# Altium schematic sheet PL_Ethernet.SchDoc: PL_Ethernet
size A3; Author: Carlos Barreiro; Organization: Escuela Técnica Superior de Ingeniería de Sistemas Informáticos de la Universidad Politécnica de Madrid; Address1: Campus Sur de la Universidad Politécnica de Madrid; Address2: Calle de Alan Turing, s/nº; Address3: Madrid 28031; Address4: España; DocumentNumber: 15; SheetNumber: 15; SheetTotal: 16
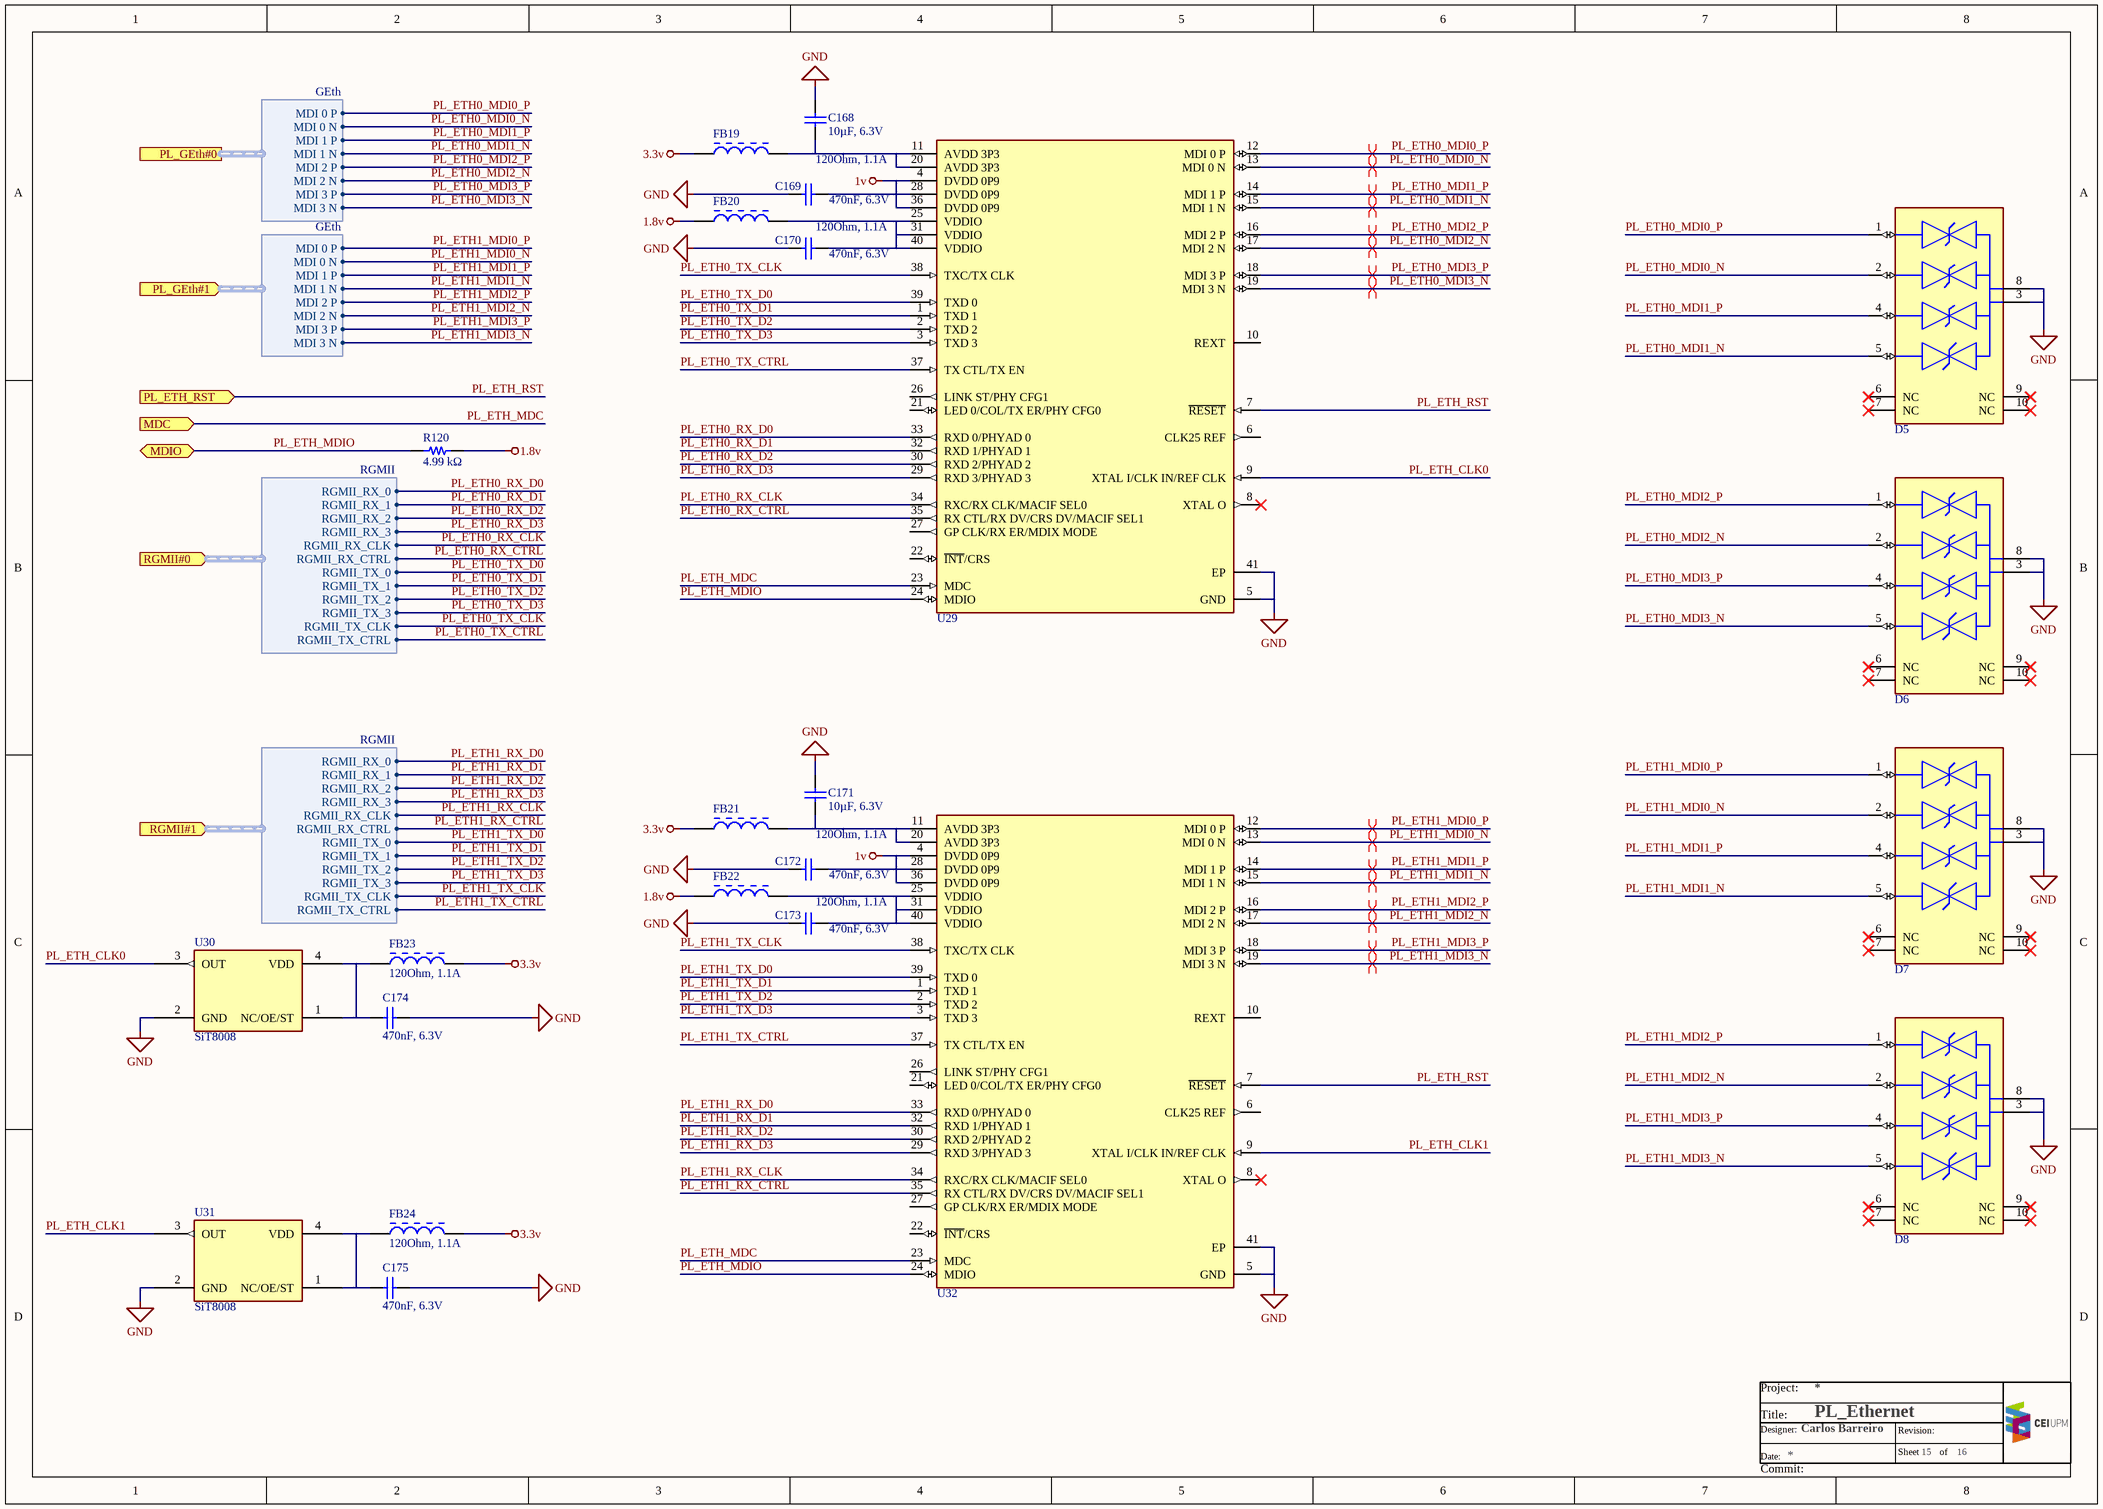
[diagram p0: PL_Ethernet.SchDoc]

## Parts
C168  10µF, 6.3V  [WURTH_WCAP-CSGP_0402]
C169  470nF, 6.3V  [WURTH_WCAP-CSGP_0402]
C170  470nF, 6.3V  [WURTH_WCAP-CSGP_0402]
C171  10µF, 6.3V  [WURTH_WCAP-CSGP_0402]
C172  470nF, 6.3V  [WURTH_WCAP-CSGP_0402]
C173  470nF, 6.3V  [WURTH_WCAP-CSGP_0402]
C174  470nF, 6.3V  [WURTH_WCAP-CSGP_0402]
C175  470nF, 6.3V  [WURTH_WCAP-CSGP_0402]
D5  ESD204DQAR  [TEXAS_USON10]  (value not drawn)
D6  ESD204DQAR  [TEXAS_USON10]  (value not drawn)
D7  ESD204DQAR  [TEXAS_USON10]  (value not drawn)
D8  ESD204DQAR  [TEXAS_USON10]  (value not drawn)
FB19  120Ohm, 1.1A  [WURTH-CBF_0402]
FB20  120Ohm, 1.1A  [WURTH-CBF_0402]
FB21  120Ohm, 1.1A  [WURTH-CBF_0402]
FB22  120Ohm, 1.1A  [WURTH-CBF_0402]
FB23  120Ohm, 1.1A  [WURTH-CBF_0402]
FB24  120Ohm, 1.1A  [WURTH-CBF_0402]
R120  4.99 kΩ  [PANASONIC_ERJ2G_0402]
U29  ADIN1300CCPZ  [ADI_LFCSP40]  (value not drawn)
U30  SiT8008  [SiTime_5032_4]
U31  SiT8008  [SiTime_5032_4]
U32  ADIN1300CCPZ  [ADI_LFCSP40]  (value not drawn)

## Ports
MDC (in), MDIO (bidir), PL_ETH_RST (in), PL_GEth#0 (harness GEth), PL_GEth#1 (in, harness GEth), RGMII#0 (in, harness RGMII), RGMII#1 (in, harness RGMII)

## Harnesses
GEth: MDI 0 P, MDI 0 N, MDI 1 P, MDI 1 N, MDI 2 P, MDI 2 N, MDI 3 P, MDI 3 N
RGMII: RGMII_RX_0, RGMII_RX_1, RGMII_RX_2, RGMII_RX_3, RGMII_RX_CLK, RGMII_RX_CTRL, RGMII_TX_0, RGMII_TX_1, RGMII_TX_2, RGMII_TX_3, RGMII_TX_CLK, RGMII_TX_CTRL

## Nets
1.8v: FB20.1 FB22.1 R120.2
1v: C169.2 C172.2 U29.4(DVDD_0P9) U29.28(DVDD_0P9) U29.36(DVDD_0P9) U32.4(DVDD_0P9) U32.28(DVDD_0P9) U32.36(DVDD_0P9)
3.3v: FB19.1 FB21.1 FB23.2 FB24.2
GND: C168.2 C169.1 C170.1 C171.2 C172.1 C173.1 C174.1 C175.1 D5.3(GND) D5.8(GND) D6.3(GND) D6.8(GND) D7.3(GND) D7.8(GND) D8.3(GND) D8.8(GND) U29.5(GND) U29.41(EP) U30.2(GND) U31.2(GND) U32.5(GND) U32.41(EP)
PL_ETH0_MDI0_N: D5.2(IO2) U29.13(MDI_0_N) ; port PL_GEth#0.MDI 0 N
PL_ETH0_MDI0_P: D5.1(IO1) U29.12(MDI_0_P) ; port PL_GEth#0.MDI 0 P
PL_ETH0_MDI1_N: D5.5(IO4) U29.15(MDI_1_N) ; port PL_GEth#0.MDI 1 N
PL_ETH0_MDI1_P: D5.4(IO3) U29.14(MDI_1_P) ; port PL_GEth#0.MDI 1 P
PL_ETH0_MDI2_N: D6.2(IO2) U29.17(MDI_2_N) ; port PL_GEth#0.MDI 2 N
PL_ETH0_MDI2_P: D6.1(IO1) U29.16(MDI_2_P) ; port PL_GEth#0.MDI 2 P
PL_ETH0_MDI3_N: D6.5(IO4) U29.19(MDI_3_N) ; port PL_GEth#0.MDI 3 N
PL_ETH0_MDI3_P: D6.4(IO3) U29.18(MDI_3_P) ; port PL_GEth#0.MDI 3 P
PL_ETH0_RX_CLK: U29.34(RXC/RX_CLK/MACIF_SEL0) ; port RGMII#0.RGMII_RX_CLK
PL_ETH0_RX_CTRL: U29.35(RX_CTL/RX_DV/CRS_DV/MACIF_SEL1) ; port RGMII#0.RGMII_RX_CTRL
PL_ETH0_RX_D0: U29.33(RXD_0/PHYAD_0) ; port RGMII#0.RGMII_RX_0
PL_ETH0_RX_D1: U29.32(RXD_1/PHYAD_1) ; port RGMII#0.RGMII_RX_1
PL_ETH0_RX_D2: U29.30(RXD_2/PHYAD_2) ; port RGMII#0.RGMII_RX_2
PL_ETH0_RX_D3: U29.29(RXD_3/PHYAD_3) ; port RGMII#0.RGMII_RX_3
PL_ETH0_TX_CLK: U29.38(TXC/TX_CLK) ; port RGMII#0.RGMII_TX_CLK
PL_ETH0_TX_CTRL: U29.37(TX_CTL/TX_EN) ; port RGMII#0.RGMII_TX_CTRL
PL_ETH0_TX_D0: U29.39(TXD_0) ; port RGMII#0.RGMII_TX_0
PL_ETH0_TX_D1: U29.1(TXD_1) ; port RGMII#0.RGMII_TX_1
PL_ETH0_TX_D2: U29.2(TXD_2) ; port RGMII#0.RGMII_TX_2
PL_ETH0_TX_D3: U29.3(TXD_3) ; port RGMII#0.RGMII_TX_3
PL_ETH1_MDI0_N: D7.2(IO2) U32.13(MDI_0_N) ; port PL_GEth#1.MDI 0 N
PL_ETH1_MDI0_P: D7.1(IO1) U32.12(MDI_0_P) ; port PL_GEth#1.MDI 0 P
PL_ETH1_MDI1_N: D7.5(IO4) U32.15(MDI_1_N) ; port PL_GEth#1.MDI 1 N
PL_ETH1_MDI1_P: D7.4(IO3) U32.14(MDI_1_P) ; port PL_GEth#1.MDI 1 P
PL_ETH1_MDI2_N: D8.2(IO2) U32.17(MDI_2_N) ; port PL_GEth#1.MDI 2 N
PL_ETH1_MDI2_P: D8.1(IO1) U32.16(MDI_2_P) ; port PL_GEth#1.MDI 2 P
PL_ETH1_MDI3_N: D8.5(IO4) U32.19(MDI_3_N) ; port PL_GEth#1.MDI 3 N
PL_ETH1_MDI3_P: D8.4(IO3) U32.18(MDI_3_P) ; port PL_GEth#1.MDI 3 P
PL_ETH1_RX_CLK: U32.34(RXC/RX_CLK/MACIF_SEL0) ; port RGMII#1.RGMII_RX_CLK
PL_ETH1_RX_CTRL: U32.35(RX_CTL/RX_DV/CRS_DV/MACIF_SEL1) ; port RGMII#1.RGMII_RX_CTRL
PL_ETH1_RX_D0: U32.33(RXD_0/PHYAD_0) ; port RGMII#1.RGMII_RX_0
PL_ETH1_RX_D1: U32.32(RXD_1/PHYAD_1) ; port RGMII#1.RGMII_RX_1
PL_ETH1_RX_D2: U32.30(RXD_2/PHYAD_2) ; port RGMII#1.RGMII_RX_2
PL_ETH1_RX_D3: U32.29(RXD_3/PHYAD_3) ; port RGMII#1.RGMII_RX_3
PL_ETH1_TX_CLK: U32.38(TXC/TX_CLK) ; port RGMII#1.RGMII_TX_CLK
PL_ETH1_TX_CTRL: U32.37(TX_CTL/TX_EN) ; port RGMII#1.RGMII_TX_CTRL
PL_ETH1_TX_D0: U32.39(TXD_0) ; port RGMII#1.RGMII_TX_0
PL_ETH1_TX_D1: U32.1(TXD_1) ; port RGMII#1.RGMII_TX_1
PL_ETH1_TX_D2: U32.2(TXD_2) ; port RGMII#1.RGMII_TX_2
PL_ETH1_TX_D3: U32.3(TXD_3) ; port RGMII#1.RGMII_TX_3
PL_ETH_CLK0: U29.9(XTAL_I/CLK_IN/REF_CLK) U30.3(OUT)
PL_ETH_CLK1: U31.3(OUT) U32.9(XTAL_I/CLK_IN/REF_CLK)
PL_ETH_MDC: U29.23(MDC) U32.23(MDC) ; port MDC
PL_ETH_MDIO: R120.1 U29.24(MDIO) U32.24(MDIO) ; port MDIO
PL_ETH_RST: U29.7(~{RESET}) U32.7(~{RESET}) ; port PL_ETH_RST
NetC168_1: C168.1 FB19.2 U29.11(AVDD_3P3) U29.20(AVDD_3P3)
NetC170_2: C170.2 FB20.2 U29.25(VDDIO) U29.31(VDDIO) U29.40(VDDIO)
NetC171_1: C171.1 FB21.2 U32.11(AVDD_3P3) U32.20(AVDD_3P3)
NetC173_2: C173.2 FB22.2 U32.25(VDDIO) U32.31(VDDIO) U32.40(VDDIO)
NetC174_2: C174.2 FB23.1 U30.1(NC/OE/ST) U30.4(VDD)
NetC175_2: C175.2 FB24.1 U31.1(NC/OE/ST) U31.4(VDD)

Not connected (* = marked no-connect by the designer): D5 6(NC)* 7(NC)* 9(NC)* 10(NC)*; D6 6(NC)* 7(NC)* 9(NC)* 10(NC)*; D7 6(NC)* 7(NC)* 9(NC)* 10(NC)*; D8 6(NC)* 7(NC)* 9(NC)* 10(NC)*; U29 6(CLK25_REF) 8(XTAL_O)* 10(REXT) 21(LED_0/COL/TX_ER/PHY_CFG0) 22(~{INT}/CRS) 26(LINK_ST/PHY_CFG1) 27(GP_CLK/RX_ER/MDIX_MODE); U32 6(CLK25_REF) 8(XTAL_O)* 10(REXT) 21(LED_0/COL/TX_ER/PHY_CFG0) 22(~{INT}/CRS) 26(LINK_ST/PHY_CFG1) 27(GP_CLK/RX_ER/MDIX_MODE)

## Layout directives
differential pair: PL_ETH0_MDI0_N, PL_ETH0_MDI0_P, PL_ETH0_MDI1_N, PL_ETH0_MDI1_P, PL_ETH0_MDI2_N, PL_ETH0_MDI2_P, PL_ETH0_MDI3_N, PL_ETH0_MDI3_P, PL_ETH1_MDI0_N, PL_ETH1_MDI0_P, PL_ETH1_MDI1_N, PL_ETH1_MDI1_P, PL_ETH1_MDI2_N, PL_ETH1_MDI2_P, PL_ETH1_MDI3_N, PL_ETH1_MDI3_P

## Notes on the sheet
- Project:
- Title:
- Date:
- Designer:
- Sheet
- Revision:
- of
- Commit:

## Library data of the parts
C168 C171 = 885012105020: WCAP-CSGP Multilayer Ceramic Chip Capacitor, General Purpose, size 0402, X5R, 10uF, 6.3V; Manufacturer: Wurth Elektronik; Rated Voltage: 6.3VDC; Isolation Resistance  min.: 0.01GOhm; Capacitance Tolerance: +/20%; Dissipation Factor max.: 10%; Technical Reference: X5R0402106M6R3DFCT10000; ComponentLink1Description: Manufacturer; ComponentLink1URL: http://www.we-online.de; ComponentLink2Description: Datasheet; ComponentLink2URL: https://www.we-online.com/catalog/datasheet/885012105020.pdf; Operating Temperature: -55 to +85degC; Packaging: Tape and Reel; Manufacturer Part Number: 885012105020; Published Date: April 2021; Ceramic Type: X5R; Height: 0.5mm; Mounting Technology: SMT; Size: 0402; Capacitance: 10uF; Q-Factor min.: -
C169 C170 C172-C175 = 885012105004: WCAP-CSGP Multilayer Ceramic Chip Capacitor, General Purpose, size 0402, X5R, 470nF, 6.3V; Manufacturer: Wurth Elektronik; Rated Voltage: 6.3VDC; Isolation Resistance  min.: 0.2GOhm; Capacitance Tolerance: +/-20%; Dissipation Factor max.: 10%; Technical Reference: X5R0402474M6R3DFCT10000; ComponentLink1Description: Manufacturer; ComponentLink1URL: http://www.we-online.de; ComponentLink2Description: Datasheet; ComponentLink2URL: https://www.we-online.com/catalog/datasheet/885012105004.pdf; Operating Temperature: -55 to +85degC; Packaging: Tape and Reel; Manufacturer Part Number: 885012105004; Published Date: April 2021; Ceramic Type: X5R; Height: 0.5mm; Mounting Technology: SMT; Size: 0402; Capacitance: 470nF; Supplier 1: Digi-Key; Supplier 2: Mouser; Supplier Part Number 1: 732-7481-1-ND; Supplier Part Number 2: 710-885012105004
D5-D8 = ESD204DQAR: ESD204 4-Channel Low-Capacitance Surge and ESD Protection Diode; Number of channels (#): 4; IO capacitance (Typ) (pF): 0.55; Vrwm (V): 3.6; Bi-/uni-directional: Bi-Directional; IO leakage current (Max) (nA): 10; Rating: Catalog; Dynamic resistance (Typ) (Ω): 0.3; Clamping voltage (V): 11.5; Operating temperature range (C): -40ºC to 125ºC; ComponentLink1Description: Manufacturer; ComponentLink1URL: https://www.ti.com/product/ESD204; Supplier 1: Digi-Key; Supplier 2: Mouser; Supplier Part Number 1: 296-49504-1-ND; Supplier Part Number 2: 595-ESD204DQAR
FB19-FB24 = 74279271: WE-CBF SMT EMI Suppression Ferrite Bead, size 0402, 120Ohm, 1.1A; Manufacturer: Wurth Elektronik; Impedance max.: 200Ohm; DC Resistance max.: 0.2Ohm; Type: Wide Band; ComponentLink1Description: Manufacturer; ComponentLink1URL: http://www.we-online.de; ComponentLink2Description: Datasheet; ComponentLink2URL: https://www.we-online.com/catalog/datasheet/74279271.pdf; Operating Temperature: -55 to +125degC; Packaging: Tape and Reel; Published Date: December 2021; Rated Current: 1.1A; Manufacturer Part Number: 74279271; Impedance @100MHz: 120Ohm; Mounting Technology: SMT; Size: 0402; Height: 0.5mm; Length: 1mm; Width: 0.5mm
R120 = ERJ2RKF4991X: General Purpose Thick Film Chip Resistors; Manufacturer: Panasonic; Power (0402): 0.1 W; Limiting Voltage (0402): 50; Maximum Voltage (0402): 100; Resistance Range (Ω): 1Ω to 100MΩ; AEC 200: Grade 0; Size (0402): 2GE; ComponentLink1Description: Catalog; ComponentLink1URL: https://industrial.panasonic.com/ww/products/pt/general-purpose-chip-resistors/models?op=search&model_status_current=1&page=0#model-list-search-results; Series: ERJ; Temperature Range (ºC): -55 to +155; Supplier 1: Digi-Key; Supplier Part Number 1: P4.99KLTR-ND
U29 U32 = ADIN1300CCPZ: Robust, Industrial, Low Latency and Low Power 10 Mbps, 100 Mbps, and 1 Gbps Ethernet PHY; MAC Interface: MII, RMII, RGMII; Package: 40-lead, 6 mm × 6 mm LFCSP; Operating Temperature: −40°C to +105°C; ComponentLink1Description: Manufacturer; ComponentLink1URL: https://www.analog.com/en/products/adin1300.html#product-tools; ComponentLink2Description: Application Note; ComponentLink2URL: https://wiki.analog.com/resources/eval/user-guides/adin1300-and-adin1200/cap-coupling#:~:text=The%20ADIN1300%20and%20ADIN1200%20are,10%2F100%20Mbps%20Ethernet%20speeds.; Supplier 1: Digi-Key; Supplier 2: Mouser; Supplier Part Number 2: 584-ADIN1300CCPZ; Supplier Part Number 1: 505-ADIN1300CCPZ-ND
U30 U31 = SiT8008: Programmable oscillator, featuring wide frequency range, low power consumption, small size and excellent stability.; Frequency: 1 to 110 MHz; Frequency Stability (ppm): ±20, ±25, ±50; Phase Jitter (rms): 1.3 ps; Output Type: LVCMOS; Voltage Supply (V): 1.8V to 3.3V; Package Type (mm²): 5.0x3.2; Operating Temperature Range (°C): -40ºC to +85ºC; ComponentLink1Description: Manufacturer; ComponentLink1URL: https://www.sitime.com/products/lvcmos-oscillators/sit8008; Supplier 1: Mouser; Supplier Part Number 1: 788-8008BI2333S1000G